# EAGLE design 4809-dip (EAGLE 7.7.0)
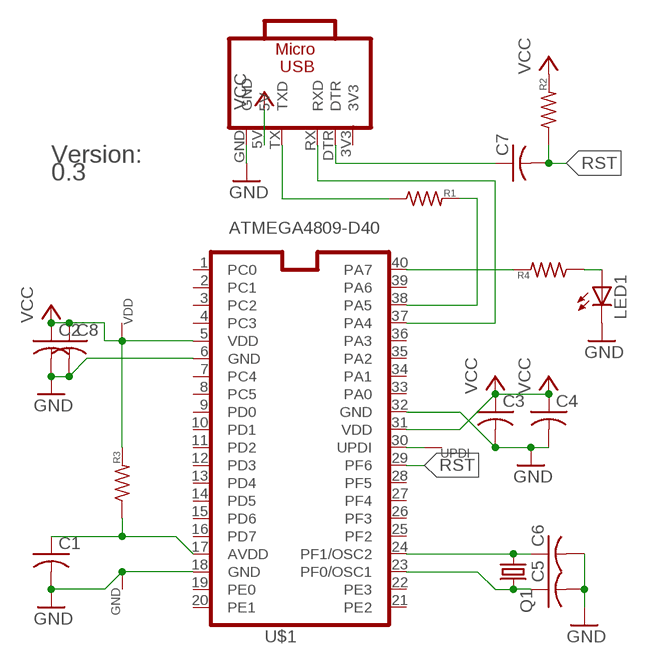
[diagram p0: schematic, sheet 1]

## Parts
C1  C-USC0805  [C0805]
C2  C-USC0805  [C0805]
C3  C-USC0805  [C0805]
C4  C-USC0805  [C0805]
C5  C-USC0805  [C0805]
C6  C-USC0805  [C0805]
C7  C-USC0805  [C0805]
C8  C-USC1206  [C1206]
GND  WIRE-R10  [VIA10]
LED1  LEDCHIP-LED0805  [CHIP-LED0805]
MOD1  CH340E-MODNOHOLES  [CH340E-MOD-NOHOLES]
Q1  CRYSTALMM20SS  [MM20SS]
R1  R-US_R0805  [R0805]
R2  R-US_R0805  [R0805]
R3  R-US_R0805  [R0805]
R4  R-US_R0805  [R0805]
U$1  ATMEGA4809-D40  [DIL40SOC]
UPDI  WIRE-R10  [VIA10]
VDD  WIRE-R10  [VIA10]
VS1  0.3  VERSIONSTRING  [VERSIONSTRING]

## Nets
CPURX: R1.2 U$1.38(PA5)
CPUTX: MOD1.RX(RXD) U$1.37(PA4)
GND [power]: C1.2 C2.2 C3.2 C4.2 C5.2 C6.2 C8.2 GND.P$1 LED1.C MOD1.GND U$1.6(GND) U$1.18(GND) U$1.32(GND)
N$1: LED1.A R4.1
N$2: R4.2 U$1.40(PA7)
N$5: C1.1 R3.1 U$1.17(AVDD)
N$6: C6.1 Q1.1 U$1.24(PF1/OSC2)
N$7: C5.1 Q1.4 U$1.23(PF0/OSC1)
N$8: C7.1 MOD1.DTR
RST: C7.2 R2.1 U$1.29(PF6)
UPDI: U$1.30(UPDI) UPDI.P$1
USBTX: MOD1.TX(TXD) R1.1
VCC [power]: C2.1 C3.1 C4.1 C8.1 MOD1.5V R2.2 R3.2 U$1.5(VDD) U$1.31(VDD) VDD.P$1
Unconnected: U$1.1(PC0) U$1.2(PC1) U$1.3(PC2) U$1.4(PC3) U$1.7(PC4) U$1.8(PC5) U$1.9(PD0) U$1.10(PD1) U$1.11(PD2) U$1.12(PD3) U$1.13(PD4) U$1.14(PD5) U$1.15(PD6) U$1.16(PD7) U$1.19(PE0) U$1.20(PE1) U$1.21(PE2) U$1.22(PE3) U$1.25(PF2) U$1.26(PF3) U$1.27(PF4) U$1.28(PF5) U$1.33(PA0) U$1.34(PA1) U$1.35(PA2) U$1.36(PA3) U$1.39(PA6)

## Power pins joined to a net without a drawn wire
3V3: MOD1.3V3

## Library data of the parts
C1-C8 = my-rcl:C-US: CAPACITOR, American symbol
GND UPDI VDD = mylib4:WIRE: Pad for a wire offboard
LED1 = my-led:LED: LED OSRAM: - CHIPLED LG R971, LG N971, LY N971, LG Q971, LY Q971, LO R971, LY R971 LH N974, LH R974 LS Q976, LO Q976, LY Q976 LO Q996 - Hyper CHIPLED LW Q18S LB Q993, LB Q99A, LB R99A - SideLED LS A670, LO A670, LY A670, LG A670, LP A670 LB A673, LV A673, LT A673, LW A673 LH A674 LY A675 LS A676, LA A676, LO A676, LY A676, LW A676 LS A679, LY A679, LG A679 - Hyper Micro SIDELED® LS Y876, LA Y876, LO Y876, LY Y876 LT Y87S - SmartLED LW L88C, LW L88S LB L89C, LB L89S, LG L890 LS L89K, LO L89K, LY L89K LS L896, LA L896, LO L896, LY L896 - TOPLED LS T670, LO T670, LY T670, LG T670, LP T670 LSG T670, LSP T670, LSY T670, LOP T670, LYG T670 LG T671, LOG T671, LSG T671 LB T673, LV T673, LT T673, LW T673 LH T674 LS T676, LA T676, LO T676, LY T676, LB T676, LH T676, LSB T676, LW T676 LB T67C, LV T67C, LT T67C, LS T67K, LO T67K, LY T67K, LW E67C LS E67B, LA E67B, LO E67B, LY E67B, LB E67C, LV E67C, LT E67C LW T67C LS T679, LY T679, LG T679 LS T770, LO T770, LY T770, LG T770, LP T770 LB T773, LV T773, LT T773, LW T773 LH T774 LS E675, LA E675, LY E675, LS T675 LS T776, LA T776, LO T776, LY T776, LB T776 LHGB T686 LT T68C, LB T68C - Hyper Mini TOPLED® LB M676 - Mini TOPLED Santana® LG M470 LS M47K, LO M47K, LY M47K Source: http://www.osram.convergy.de/
MOD1 = mini-usb:CH340E-MOD
Q1 = mylib4:CRYSTAL: CRYSTAL
R1-R4 = my-rcl:R-US_: RESISTOR, American symbol
U$1 = avr:ATMEGA4809-D40
VS1 = mylib4:VERSIONSTRING

## Net classes
0 default: width 0.4 mm, clearance 0.01 mm
1 power: width 0.8 mm, clearance 0.015 mm

## Board
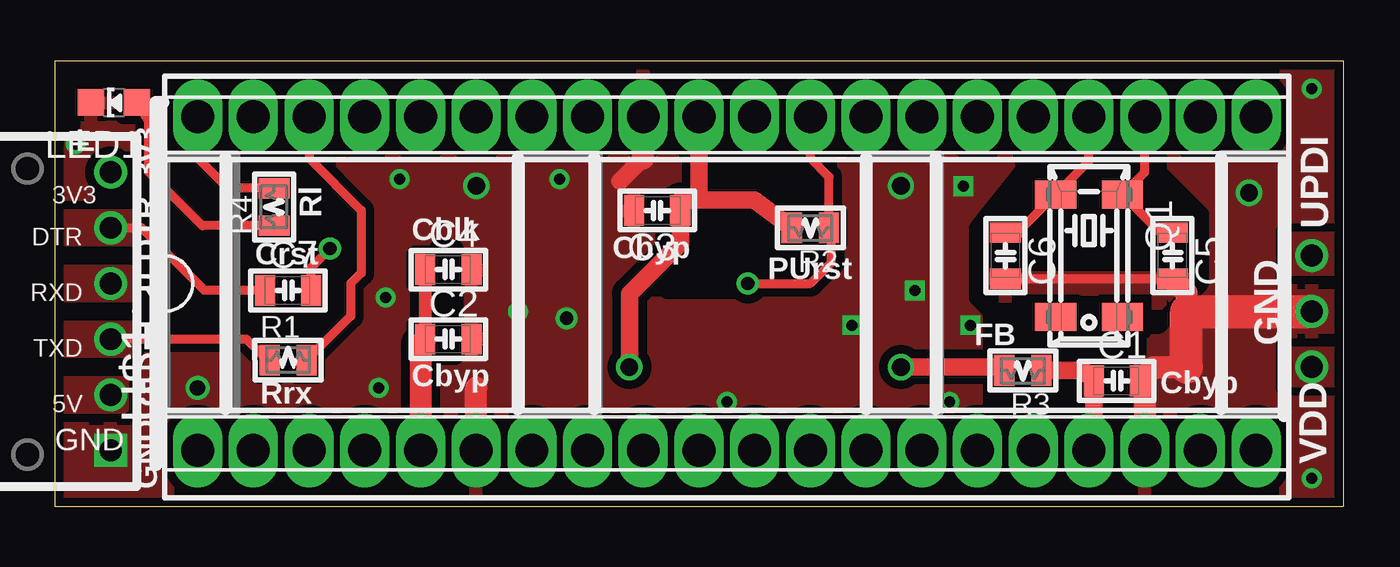
[diagram p1: board, top side]
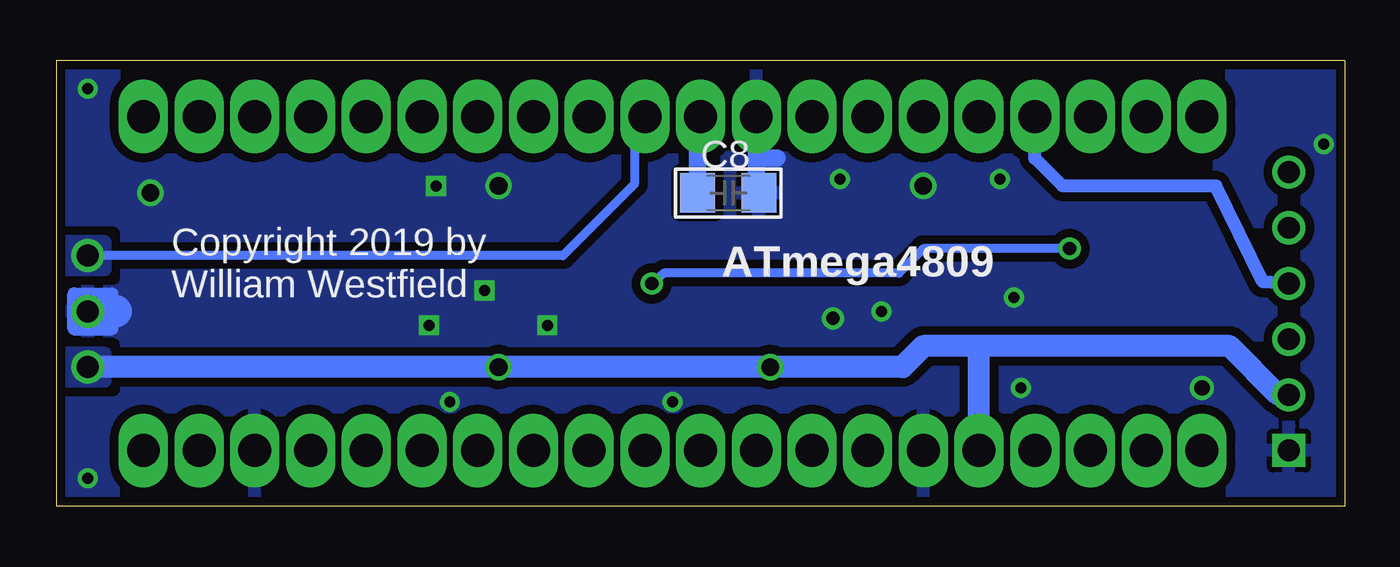
[diagram p2: board, bottom side, seen from below]

Size 58.74 x 20.32 mm. Coordinates in mm from the lower left corner, seen from the top.
Outline: 0,0 58.74,0 58.74,20.32 0,20.32 0,0
Copper layers (1*16): Top 0.035mm / dielectric 1.5mm / Bottom 0.035mm
Design rules "default *": minimum track width 10mil, minimum drill 0.5mm, track to track 8mil, track to pad 8mil, pad to pad 8mil, via to via 8mil, smd to smd 8mil, copper to edge 16mil, drill to drill 8mil, minimum pad ring 10mil, minimum via ring 8mil, stop-mask expansion 0mil, vias tented up to drill 0.55mm, thermal gap 10mil
tRestrict: area 46.8,7.9 to 47.5,9.2; area 17.5,6.8 to 18.3,11.7; area 10.3,9.2 to 11,10.5; area 48.1,5.1 to 48.7,6.3; area 27.1,12.9 to 27.8,14.1; area 0.2,17.5 to 0.8,18.7; area 1.3,19.2 to 2.5,19.8; area 27.9,9.8 to 29.2,10.5; area 29.5,9.8 to 30.8,10.5; area 42.7,7.3 to 43.3,8.6; area 42.7,4.4 to 44,5.1; area 48.1,7 to 49.4,7.6; 10 lines

### Footprints (pad centres in the part's own frame; a part is rotated, then mirrored left to right if it is on the bottom)
C0805 = smd 0.914 x 1.397: 1 -1.053,0; 2 1.053,0
C1206 = smd 1.6 x 1.8: 1 -1.4,0; 2 1.4,0
VIA10 = drill 1: P$1 0,0
CHIP-LED0805 = smd 1.2 x 1.2: A 0,-1.05; C 0,1.05
CH340E-MOD-NOHOLES = drill 1: 3V3 6.35,6.35; 5V 6.35,-3.81; DTR 6.35,3.81; RX 6.35,1.27; TX 6.35,-1.27 | drill 1 square: GND 6.35,-6.35
MM20SS = smd 1.27 x 1.88: 1 -2.794,-1.524; 2 2.794,-1.524; 3 2.794,1.524; 4 -2.794,1.524
R0805 = smd 0.914 x 1.397: 1 -0.85,0; 2 0.85,0
DIL40SOC = drill 1.5 long: 1 -22.86,-7.62; 2 -20.32,-7.62; 3 -17.78,-7.62; 4 -15.24,-7.62; 5 -12.7,-7.62; 6 -10.16,-7.62; 7 -7.62,-7.62; 8 -5.08,-7.62; 9 -2.54,-7.62; 10 0,-7.62; 11 2.54,-7.62; 12 5.08,-7.62; 13 7.62,-7.62; 14 10.16,-7.62; 15 12.7,-7.62; 16 15.24,-7.62; 17 17.78,-7.62; 18 20.32,-7.62; 19 22.86,-7.62; 20 25.4,-7.62; 21 25.4,7.62; 22 22.86,7.62; 23 20.32,7.62; 24 17.78,7.62; 25 15.24,7.62; 26 12.7,7.62; 27 10.16,7.62; 28 7.62,7.62; 29 5.08,7.62; 30 2.54,7.62; 31 0,7.62; 32 -2.54,7.62; 33 -5.08,7.62; 34 -7.62,7.62; 35 -10.16,7.62; 36 -12.7,7.62; 37 -15.24,7.62; 38 -17.78,7.62; 39 -20.32,7.62; 40 -22.86,7.62

### Placement (x,y rotation side)
C1  48.42,5.71 0 top
C2  17.94,7.62 0 top
C3  27.46,13.49 180 top
C4  17.94,10.79 0 top
C5  50.96,11.43 270 top
C6  43.34,11.43 270 top
C7  10.64,9.84 0 top
C8  28.1,14.29 0 bottom
GND  57.31,8.89 0 top
LED1  2.7,18.41 90 top
MOD1  -3.81,8.89 0 top
Q1  47.15,11.43 270 top
R1  10.64,6.67 0 top
R2  34.45,12.7 180 top
R3  44.13,6.19 180 top
R4  10,13.65 90 top
U$1  29.37,10.16 0 top
UPDI  57.31,11.43 0 top
VDD  57.31,6.35 0 top
VS1  37.62,9.52 0 top

### Tracks (layer width: path | path; a pad name or v marks a point on that pad's centre or on a via)
CPURX
  Top 0.4: U$1.38 11.59,15.88 13.97,13.49 13.97,10.64 13.49,10.16 13.49,8.67 R1.2
CPUTX
  Bottom 0.6: MOD1.RX 3.73,10.24 5.87,14.6 12.86,14.6 14.13,15.88 U$1.37
  pour Top (isolate 0.4, rank 3, no thermals): -0.64,10.79 -0.64,9.52 3.49,9.52 3.49,10.79
GND  (via drill 0.5, 0.6, 0.7, 0.8)
  Top 0.4: C6.2 C5.2
  Top 0.8: 26.83,15.88 25.78,14.82
  Top 1: 26.83,15.88 U$1.32 | U$1.18 49.69,5.5 C1.2 50.11,6.35 51.59,6.35 51.59,9.74 C5.2 | U$1.6 19.21,5.4
  Top 1.5: 51.59,6.35 51.59,8.89 GND.P$1
  Bottom 0.6: 57.94,9.52 GND.P$1 57.31,8.73 57.94,8.1 | 57.94,9.52 57.94,9.68 56.2,9.68 | 57.94,8.1 56.2,8.1 | 57.94,8.1 57.94,9.52
  Bottom 0.8: U$1.32 26.83,15.88 | 25.88,15.88 26.83,15.88 | 26.83,15.88 26.83,13.97
  Bottom 1.5: GND.P$1 56.04,8.89
  other vias: 15.72,14.92 19.21,14.6 23.02,14.92 41.43,14.6 38.58,14.6 6.51,5.4 15.08,9.52 21.11,8.89 54.45,14.29 14.76,5.4 41.75,8.25 57.31,19.05 36.35,8.25 23.34,8.57 57.31,1.27 39.21,9.84 30.64,4.76 40.8,4.76 0.95,16.51
  pour Top (isolate 0.4, rank 4): -1.75,20.64 59.53,20.64 59.53,-0.64 -1.75,-0.64
  pour Bottom (isolate 0.4, rank 4): -2.38,21.59 59.53,21.27 59.53,-2.22 -2.38,-1.91
  pour Top (isolate 0.4, rank 3, no thermals): -0.64,3.49 -0.64,1.59 3.49,1.59 3.49,3.49
  pour Top (isolate 0.4, rank 3, no thermals): 56.36,9.68 56.36,8.1 60.17,8.1 60.17,9.68
N$1
  Top 0.4: R4.1 6.72,12.8 4.29,15.24 4.29,17.56 LED1.A
N$2
  Top 0.4: R4.2 7.88,14.5 6.51,15.88 U$1.40
N$5
  Top 0.8: R3.1 46.89,6.19 C1.1 47.37,2.54 U$1.17
N$6
  Top 0.4: U$1.24 47.15,15.75 Q1.1 43.88,12.48
  Top 0.6: C6.1 43.88,12.48
N$7
  Top 0.4: U$1.23 49.69,15.24 Q1.4 50.41,12.48 C5.1
N$8
  Top 0.4: C7.1 6.83,9.84 3.97,12.7 MOD1.DTR
  pour Top (isolate 0.4, rank 3, no thermals): -0.64,13.34 -0.64,12.06 3.49,12.06 3.49,13.34
RST  (via drill 0.6)
  Top 0.4: U$1.29 34.45,15.88 35.3,15.02 R2.1 35.4,12.6 35.4,11.11 34.45,10.16 v31.59,10.16 | C7.2 11.69,10.9 v12.54,11.75
  Bottom 0.4: v12.54,11.75 19.21,11.75 20.32,10.64 31.04,10.64 v31.59,10.16
UPDI
  Bottom 0.4: U$1.30 31.91,16.91 32.38,16.43 32.38,14.68 35.64,11.43 UPDI.P$1
  pour Top (isolate 0.4, rank 2, no thermals): 56.36,12.22 59.06,12.22 59.06,10.79 56.36,10.79
  pour Bottom (isolate 0.4, rank 2, no thermals): 56.52,12.06 58.9,12.06 58.9,10.79 56.52,10.79
USBTX
  Top 0.4: MOD1.TX 8.73,7.62 9.68,6.67 R1.1
  pour Top (isolate 0.4, rank 3, no thermals): -0.64,8.25 -0.64,6.98 3.49,6.98 3.49,8.25
VCC  (via drill 0.8)
  Top 0.6: C4.1 C2.1
  Top 0.8: R2.2 31.91,13.97 29.37,13.97 | U$1.31 29.37,13.97 | 29.37,13.97 28.52,13.97 C3.1 28.52,12.01 26.19,9.68 v26.19,6.35 | R3.2 43.12,6.35 v38.58,6.35
  Top 1: C2.1 16.67,7.4 U$1.5
  Bottom 0.8: C8.1 29.5,17.65 U$1.31
  Bottom 1: MOD1.5V 3.02,5.08 5.24,7.3 16.67,7.3 | 16.67,7.3 19.21,7.3 20.16,6.35 v26.19,6.35 v38.58,6.35 VDD.P$1 | U$1.5 16.67,7.3
  pour Top (isolate 0.4, rank 2, no thermals): 56.36,6.98 59.06,6.98 59.06,5.71 56.36,5.71
  pour Bottom (isolate 0.4, rank 2, no thermals): 56.52,6.98 58.9,6.98 58.9,5.71 56.52,5.71
  pour Top (isolate 0.4, rank 3, no thermals): 3.18,4.45 3.18,5.71 -0.64,5.71 -0.64,4.45

### Text on the board
bPlace: ATmega4809 | Copyright 2019 by / William Westfield
History: 20190830 by WestfW: RX/TX reversed, damn it. Fix.
_tSilk: 3v3 | L | DTR | Rl | Cblk | Cbyp | UPDI | Crst | PUrst | R | T | FB | GND | 5 | Cbyp | Cbyp | GND | Rrx | VDD
_bplace: ATmega4809 | Version | Copyright 2019 by William Westfield